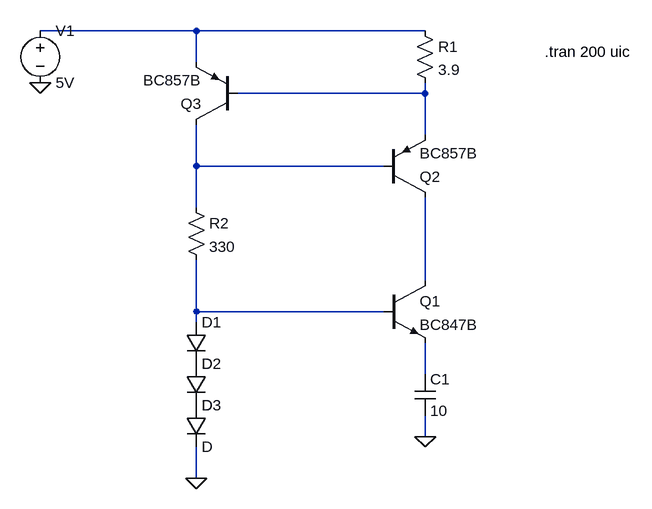
[diagram p0: schematic NiMH_charger.asc]
NiMH_charger.asc, the LTspice schematic file:
Version 4
SHEET 1 880 756
WIRE -96 -48 -336 -48
WIRE 256 -48 -96 -48
WIRE -96 0 -96 -48
WIRE 256 48 256 32
WIRE 256 48 -32 48
WIRE 256 112 256 48
WIRE -96 160 -96 96
WIRE 192 160 -96 160
WIRE -96 224 -96 160
WIRE 256 336 256 208
WIRE -96 384 -96 304
WIRE 192 384 -96 384
WIRE -96 400 -96 384
WIRE 256 480 256 432
WIRE 256 576 256 544
WIRE -96 640 -96 592
FLAG -336 32 0
FLAG 256 576 0
FLAG -96 640 0
SYMBOL npn 192 336 R0
SYMATTR InstName Q1
SYMATTR Value BC847B
SYMBOL pnp 192 208 M180
SYMATTR InstName Q2
SYMATTR Value BC857B
SYMBOL pnp -32 96 R180
SYMATTR InstName Q3
SYMATTR Value BC857B
SYMBOL res 240 -64 R0
SYMATTR InstName R1
SYMATTR Value 3.9
SYMBOL res -112 208 R0
SYMATTR InstName R2
SYMATTR Value 330
SYMBOL voltage -336 -64 R0
WINDOW 123 0 0 Left 2
WINDOW 39 0 0 Left 2
SYMATTR InstName V1
SYMATTR Value 5V
SYMBOL cap 240 480 R0
SYMATTR InstName C1
SYMATTR Value 10
SYMBOL diode -112 400 R0
SYMATTR InstName D1
SYMBOL diode -112 464 R0
SYMATTR InstName D2
SYMBOL diode -112 528 R0
SYMATTR InstName D3
TEXT 440 -16 Left 2 !.tran 200 uic

The netlist it stands for:
* NiMH_charger.asc
Q1 N004 N005 N006 0 BC847B
Q2 N004 N003 N002 0 BC857B
Q3 N003 N002 N001 0 BC857B
R1 N001 N002 3.9
R2 N003 N005 330
V1 N001 0 5V
C1 N006 0 10
D1 N005 P001 D
D2 P001 P002 D
D3 P002 0 D
.model D D
.lib standard.dio
.model NPN NPN
.model PNP PNP
.lib standard.bjt
.tran 200 uic
.backanno
.end